# Altium project Multi_EMRT_MC.PrjPCB
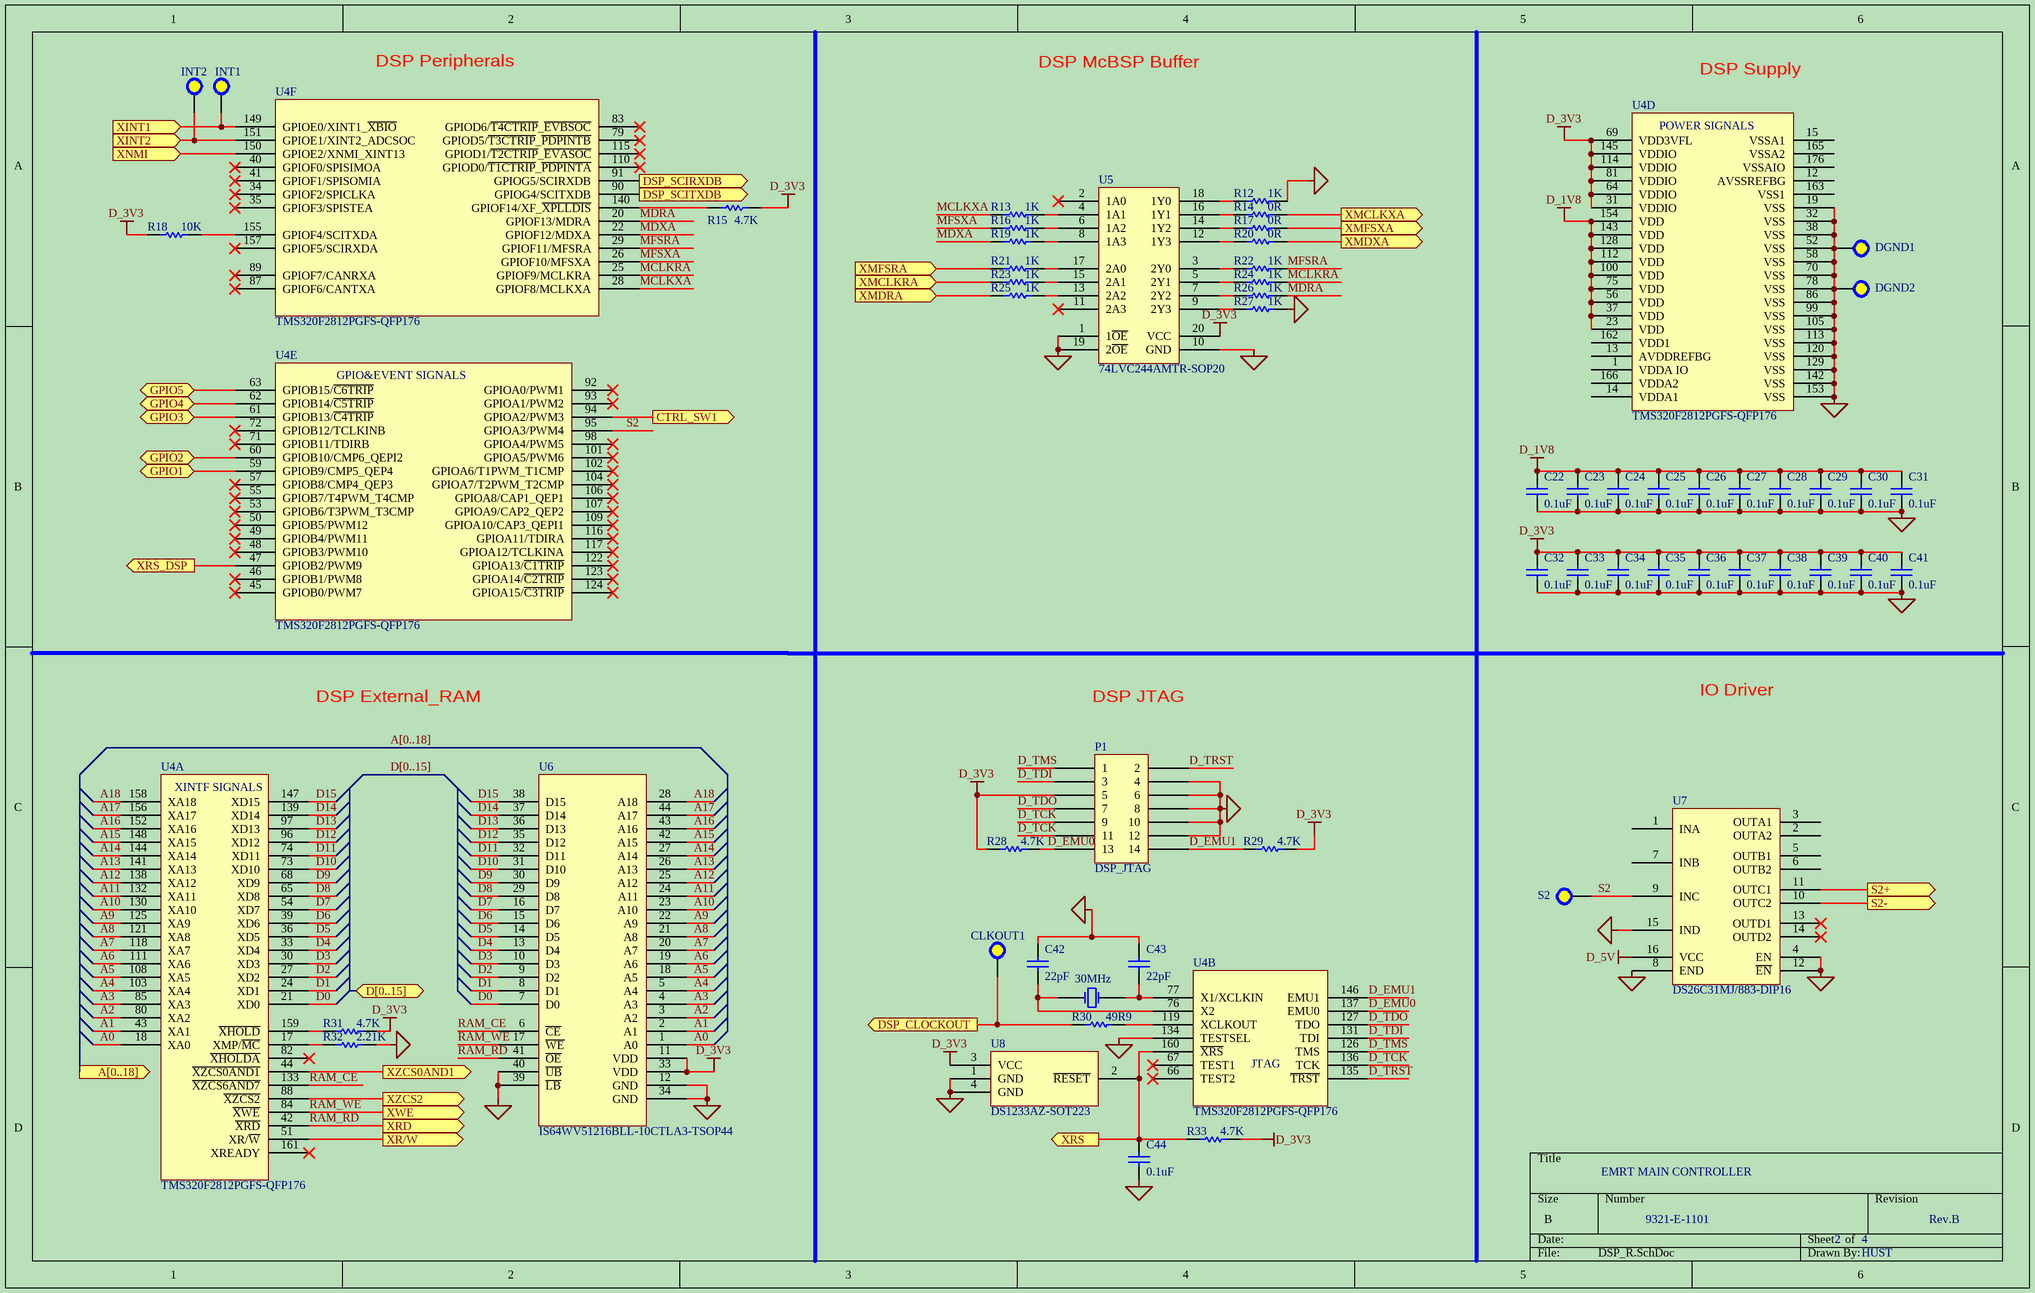
[diagram p0: DSP_R.SchDoc]
3 sheets, 148 parts. Net scope: flat (ports and power ports of the same name join across sheets).
Board file: Multi_EMRT_MC.PcbDoc
Sheets:
  DSP_R.SchDoc
  Assistant_Parameters.SchDoc
  ADC.SchDoc

## Sheet DSP_R.SchDoc: EMRT MAIN CONTROLLER
size B; DrawnBy: HUST; DocumentNumber: 9321-E-1101; Revision: Rev.B; SheetNumber: 2; SheetTotal: 4; PageSetup: Record=PageOptions|CenterHorizontal=True|CenterVertical=True|PrintScale=0.96|XCorrection=1.00|YCorrection=1.00|PrintKind=1|BorderSize=5000000|LeftOffset=0|BottomOffset=0|Orientation=2|PaperLength=1000|PaperWidth=1000|Scale=100|PaperSource=7|PrintQuality=1200|MediaType=0|DitherType=0|PaperKind=A4|PrintScaleMode=1

### Parts
C22  value 0.1uF  [CAPS0805_57]  (hidden comment: Cap)
C23  value 0.1uF  [CAPS0805_57]  (hidden comment: Cap)
C24  value 0.1uF  [CAPS0805_57]  (hidden comment: Cap)
C25  value 0.1uF  [CAPS0805_57]  (hidden comment: Cap)
C26  value 0.1uF  [CAPS0805_57]  (hidden comment: Cap)
C27  value 0.1uF  [CAPS0805_57]  (hidden comment: Cap)
C28  value 0.1uF  [CAPS0805_57]  (hidden comment: Cap)
C29  value 0.1uF  [CAPS0805_57]  (hidden comment: Cap)
C30  value 0.1uF  [CAPS0805_57]  (hidden comment: Cap)
C31  value 0.1uF  [CAPS0805_57]  (hidden comment: Cap)
C32  value 0.1uF  [CAPS0805_57]  (hidden comment: Cap)
C33  value 0.1uF  [CAPS0805_57]  (hidden comment: Cap)
C34  value 0.1uF  [CAPS0805_57]  (hidden comment: Cap)
C35  value 0.1uF  [CAPS0805_57]  (hidden comment: Cap)
C36  value 0.1uF  [CAPS0805_57]  (hidden comment: Cap)
C37  value 0.1uF  [CAPS0805_57]  (hidden comment: Cap)
C38  value 0.1uF  [CAPS0805_57]  (hidden comment: Cap)
C39  value 0.1uF  [CAPS0805_57]  (hidden comment: Cap)
C40  value 0.1uF  [CAPS0805_57]  (hidden comment: Cap)
C41  value 0.1uF  [CAPS0805_57]  (hidden comment: Cap)
C42  value 22pF  [CAPS0805_57]  (hidden comment: Cap)
C43  value 22pF  [CAPS0805_57]  (hidden comment: Cap)
C44  value 0.1uF  [CAPS0805_57]  (hidden comment: Cap)
CLKOUT1  TEST_SMALL  [test_small]  (value not drawn)
DGND1  TST_LARGE  [test_large]  (value not drawn)
DGND2  TST_LARGE  [test_large]  (value not drawn)
INT1  TEST_SMALL  [test_small]  (value not drawn)
INT2  TEST_SMALL  [test_small]  (value not drawn)
P1  DSP_JTAG  [HDR2X7]
R12  value 1K  [RESS0805]  (hidden comment: Res)
R13  value 1K  [RESS0805]  (hidden comment: Res)
R14  value 0R  [RESS0805]  (hidden comment: Res)
R15  value 4.7K  [RESS0805]  (hidden comment: Res)
R16  value 1K  [RESS0805]  (hidden comment: Res)
R17  value 0R  [RESS0805]  (hidden comment: Res)
R18  value 10K  [RESS0805]  (hidden comment: Res)
R19  value 1K  [RESS0805]  (hidden comment: Res)
R20  value 0R  [RESS0805]  (hidden comment: Res)
R21  value 1K  [RESS0805]  (hidden comment: Res)
R22  value 1K  [RESS0805]  (hidden comment: Res)
R23  value 1K  [RESS0805]  (hidden comment: Res)
R24  value 1K  [RESS0805]  (hidden comment: Res)
R25  value 1K  [RESS0805]  (hidden comment: Res)
R26  value 1K  [RESS0805]  (hidden comment: Res)
R27  value 1K  [RESS0805]  (hidden comment: Res)
R28  value 4.7K  [RESS0805]  (hidden comment: Res)
R29  value 4.7K  [RESS0805]  (hidden comment: Res)
R30  value 49R9  [RESS0805]  (hidden comment: Res)
R31  value 4.7K  [RESS0805]  (hidden comment: Res)
R32  value 2.21K  [RESS0805]  (hidden comment: Res)
R33  value 4.7K  [RESS0805]  (hidden comment: Res)
S2  TST_LARGE  [test_large]  (value not drawn)
U4  TMS320F2812PGFS-QFP176  [QFP176]  (parts A,B,D,E,F of 6)
U5  74LVC244AMTR-SOP20  [B-PDSO_20q1280×1030×265_p127]
U6  IS64WV51216BLL-10CTLA3-TSOP44  [TSOP44]
U7  DS26C31MJ/883-DIP16  [CDIP_16q785×305×200_d18_p100_i300]
U8  DS1233AZ-SOT223  [PDSO_3q700×650×180_p230]
Y1  XTAL  [XTALBCY_2q311×126×236_d13_p150]  (value not drawn)

### Ports
A[0..18] (out), CTRL_SW1 (out), D[0..15] (bidir), DSP_CLOCKOUT (out), DSP_SCIRXDB (in), DSP_SCITXDB (out), GPIO1 (bidir), GPIO2 (bidir), GPIO3 (bidir), GPIO4 (bidir), GPIO5 (bidir), S2+ (out), S2- (out), XINT1 (in), XINT2 (in), XMCLKRA (in), XMCLKXA (out), XMDRA (in), XMDXA (out), XMFSRA (in), XMFSXA (out), XNMI (in), XR/W (out), XRD (out), XRS (out), XRS_DSP (out), XWE (out), XZCS0AND1 (out), XZCS2 (out)

### Nets
D_1V8: C22.2 C23.2 C24.2 C25.2 C26.2 C27.2 C28.2 C29.2 C30.2 C31.2 U4.23(VDD) U4.37(VDD) U4.56(VDD) U4.75(VDD) U4.100(VDD) U4.112(VDD) U4.128(VDD) U4.143(VDD) U4.154(VDD)
D_3V3: C32.2 C33.2 C34.2 C35.2 C36.2 C37.2 C38.2 C39.2 C40.2 C41.2 P1.5 R15.1 R18.2 R28.2 R29.1 R31.1 R33.1 U4.31(VDDIO) U4.64(VDDIO) U4.69(VDD3VFL) U4.81(VDDIO) U4.114(VDDIO) U4.145(VDDIO) U5.20(VCC) U6.11(VDD) U6.33(VDD) U8.3(VCC)
D_5V: U7.16(VCC)
DGND: C22.1 C23.1 C24.1 C25.1 C26.1 C27.1 C28.1 C29.1 C30.1 C31.1 C32.1 C33.1 C34.1 C35.1 C36.1 C37.1 C38.1 C39.1 C40.1 C41.1 C42.2 C43.2 C44.1 DGND1.1 DGND2.1 P1.4 P1.6 P1.8 P1.10 P1.12 R12.1 R27.1 R32.1 U4.19(VSS) U4.32(VSS) U4.38(VSS) U4.52(VSS) U4.58(VSS) U4.70(VSS) U4.78(VSS) U4.86(VSS) U4.99(VSS) U4.105(VSS) U4.113(VSS) U4.120(VSS) U4.129(VSS) U4.134(TESTSEL) U4.142(VSS) U4.153(VSS) U5.1(1~{OE}) U5.10(GND) U5.19(2~{OE}) U6.12(GND) U6.34(GND) U6.39(~{LB}) U6.40(~{UB}) U7.4(EN) U7.8(END) U7.12(~{EN}) U7.15(IND) U8.1(GND) U8.4(GND)
A0: U4.18(XA0) U6.1(A0)
A1: U4.43(XA1) U6.2(A1)
A2: U4.80(XA2) U6.3(A2)
A3: U4.85(XA3) U6.4(A3)
A4: U4.103(XA4) U6.5(A4)
A5: U4.108(XA5) U6.18(A5)
A6: U4.111(XA6) U6.19(A6)
A7: U4.118(XA7) U6.20(A7)
A8: U4.121(XA8) U6.21(A8)
A9: U4.125(XA9) U6.22(A9)
A10: U4.130(XA10) U6.23(A10)
A11: U4.132(XA11) U6.24(A11)
A12: U4.138(XA12) U6.25(A12)
A13: U4.141(XA13) U6.26(A13)
A14: U4.144(XA14) U6.27(A14)
A15: U4.148(XA15) U6.42(A15)
A16: U4.152(XA16) U6.43(A16)
A17: U4.156(XA17) U6.44(A17)
A18: U4.158(XA18) U6.28(A18)
D0: U4.21(XD0) U6.7(D0)
D1: U4.24(XD1) U6.8(D1)
D2: U4.27(XD2) U6.9(D2)
D3: U4.30(XD3) U6.10(D3)
D4: U4.33(XD4) U6.13(D4)
D5: U4.36(XD5) U6.14(D5)
D6: U4.39(XD6) U6.15(D6)
D7: U4.54(XD7) U6.16(D7)
D8: U4.65(XD8) U6.29(D8)
D9: U4.68(XD9) U6.30(D9)
D10: U4.73(XD10) U6.31(D10)
D11: U4.74(XD11) U6.32(D11)
D12: U4.96(XD12) U6.35(D12)
D13: U4.97(XD13) U6.36(D13)
D14: U4.139(XD14) U6.37(D14)
D15: U4.147(XD15) U6.38(D15)
D_EMU0: P1.13 R28.1 U4.137(EMU0)
D_EMU1: P1.14 R29.2 U4.146(EMU1)
D_TCK: P1.9 P1.11 U4.136(TCK)
D_TDI: P1.3 U4.131(TDI)
D_TDO: P1.7 U4.127(TDO)
D_TMS: P1.1 U4.126(TMS)
D_TRST: P1.2 U4.135(~{TRST})
MCLKRA: R24.1 U4.25(GPIOF9/MCLKRA)
MCLKXA: R13.2 U4.28(GPIOF8/MCLKXA)
MDRA: R26.1 U4.20(GPIOF13/MDRA)
MDXA: R19.2 U4.22(GPIOF12/MDXA)
MFSRA: R22.1 U4.29(GPIOF11/MFSRA)
MFSXA: R16.2 U4.26(GPIOF10/MFSXA)
RAM_CE: U4.133(~{XZCS6AND7}) U6.6(~{CE})
RAM_RD: U4.42(~{XRD}) U6.41(~{OE}) ; port XRD
RAM_WE: U4.84(~{XWE}) U6.17(~{WE}) ; port XWE
S2: S2.1 U4.95(GPIOA3/PWM4) U7.9(INC)
NetC42_1: C42.1 U4.76(X2) Y1.2(OSC2)
NetC43_1: C43.1 U4.77(X1/XCLKIN) Y1.1(OSC1)
NetC44_2: C44.2 R33.2 U4.160(~{XRS}) U8.2(~{RESET}) ; port XRS
NetCLKOUT1_1: CLKOUT1.1 R30.2 ; port DSP_CLOCKOUT
NetCTRL_SW1_1: U4.94(GPIOA2/PWM3) ; port CTRL_SW1
NetINT1_1: INT1.1 U4.149(GPIOE0/XINT1_~{XBIO}) ; port XINT1
NetINT2_1: INT2.1 U4.151(GPIOE1/XINT2_ADCSOC) ; port XINT2
NetR12_2: R12.2 U5.18(1Y0)
NetR13_1: R13.1 U5.4(1A1)
NetR14_1: R14.1 ; port XMCLKXA
NetR14_2: R14.2 U5.16(1Y1)
NetR15_2: R15.2 U4.140(GPIOF14/XF_~{XPLLDIS})
NetR16_1: R16.1 U5.6(1A2)
NetR17_1: R17.1 ; port XMFSXA
NetR17_2: R17.2 U5.14(1Y2)
NetR18_1: R18.1 U4.155(GPIOF4/SCITXDA)
NetR19_1: R19.1 U5.8(1A3)
NetR20_1: R20.1 ; port XMDXA
NetR20_2: R20.2 U5.12(1Y3)
NetR21_1: R21.1 U5.17(2A0)
NetR21_2: R21.2 ; port XMFSRA
NetR22_2: R22.2 U5.3(2Y0)
NetR23_1: R23.1 U5.15(2A1)
NetR23_2: R23.2 ; port XMCLKRA
NetR24_2: R24.2 U5.5(2Y1)
NetR25_1: R25.1 U5.13(2A2)
NetR25_2: R25.2 ; port XMDRA
NetR26_2: R26.2 U5.7(2Y2)
NetR27_2: R27.2 U5.9(2Y3)
NetR30_1: R30.1 U4.119(XCLKOUT)
NetR31_2: R31.2 U4.159(~{XHOLD})
NetR32_2: R32.2 U4.17(XMP/~{MC})
NetU4_44: U4.44(~{XZCS0AND1}) ; port XZCS0AND1
NetU4_47: U4.47(GPIOB2/PWM9) ; port XRS_DSP
NetU4_51: U4.51(XR/~{W}) ; port XR/W
NetU4_59: U4.59(GPIOB9/CMP5_QEP4) ; port GPIO1
NetU4_60: U4.60(GPIOB10/CMP6_QEPI2) ; port GPIO2
NetU4_61: U4.61(GPIOB13/~{C4TRIP}) ; port GPIO3
NetU4_62: U4.62(GPIOB14/~{C5TRIP}) ; port GPIO4
NetU4_63: U4.63(GPIOB15/~{C6TRIP}) ; port GPIO5
NetU4_88: U4.88(~{XZCS2}) ; port XZCS2
NetU4_90: U4.90(GPIOG4/SCITXDB) ; port DSP_SCITXDB
NetU4_91: U4.91(GPIOG5/SCIRXDB) ; port DSP_SCIRXDB
NetU4_150: U4.150(GPIOE2/XNMI_XINT13) ; port XNMI
NetU7_10: U7.10(OUTC2) ; port S2-
NetU7_11: U7.11(OUTC1) ; port S2+

Not connected (* = marked no-connect by the designer): U4 1(VDDA_IO) 12(AVSSREFBG) 13(AVDDREFBG) 14(VDDA1) 15(VSSA1) 34(GPIOF2/SPICLKA)* 35(GPIOF3/SPISTEA)* 40(GPIOF0/SPISIMOA)* 41(GPIOF1/SPISOMIA)* 45(GPIOB0/PWM7)* 46(GPIOB1/PWM8)* 48(GPIOB3/PWM10)* 49(GPIOB4/PWM11)* 50(GPIOB5/PWM12)* 53(GPIOB6/T3PWM_T3CMP)* 55(GPIOB7/T4PWM_T4CMP)* 57(GPIOB8/CMP4_QEP3)* 66(TEST2)* 67(TEST1)* 71(GPIOB11/TDIRB)* 72(GPIOB12/TCLKINB)* 79(GPIOD5/~{T3CTRIP}_~{PDPINTB})* 82(~{XHOLDA})* 83(GPIOD6/~{T4CTRIP}_~{EVBSOC})* 87(GPIOF6/CANTXA)* 89(GPIOF7/CANRXA)* 92(GPIOA0/PWM1)* 93(GPIOA1/PWM2)* 98(GPIOA4/PWM5)* 101(GPIOA5/PWM6)* 102(GPIOA6/T1PWM_T1CMP)* 104(GPIOA7/T2PWM_T2CMP)* 106(GPIOA8/CAP1_QEP1)* 107(GPIOA9/CAP2_QEP2)* 109(GPIOA10/CAP3_QEPI1)* 110(GPIOD0/~{T1CTRIP}_~{PDPINTA})* 115(GPIOD1/~{T2CTRIP}_~{EVASOC})* 116(GPIOA11/TDIRA)* 117(GPIOA12/TCLKINA)* 122(GPIOA13/~{C1TRIP})* 123(GPIOA14/~{C2TRIP})* 124(GPIOA15/~{C3TRIP})* 157(GPIOF5/SCIRXDA)* 161(XREADY)* 162(VDD1) 163(VSS1) 165(VSSA2) 166(VDDA2) 176(VSSAIO); U5 2(1A0)* 11(2A3)*; U7 1(INA) 2(OUTA2) 3(OUTA1) 5(OUTB1) 6(OUTB2) 7(INB) 13(OUTD1)* 14(OUTD2)*

### Buses and harness runs
bus A[0..18] = port A[0..18]
bus D[0..15] = port D[0..15]

### Notes on the sheet
- DSP Peripherals
- DSP McBSP Buffer
- DSP Supply
- DSP External_RAM
- DSP JTAG
- IO Driver
- (in symbol TMS320F2812(176PIN), part A) XINTF SIGNALS
- (in symbol TMS320F2812(176PIN), part B) JTAG
- (in symbol TMS320F2812(176PIN), part D) POWER SIGNALS
- (in symbol TMS320F2812(176PIN), part E) GPIO&EVENT SIGNALS
- (in symbol XTAL) 30MHz

### Library data of the parts
C22-C44 = Y20025084: Capacitor; 制造商型号: VJ0805H104KXA; parent: 01; 精度: ±10%; 描述: VISHAY;VJ0805H104KXA;0.1uF;±10%;50V;X8R;150℃;CAP0805; 安装形式: SMT; 湿敏等级（回流焊峰值）: 0; 产品外形尺寸<长>: 0.079±0.008 in; 产品外形尺寸<宽>: 0.049±0.008 in; 产品外形尺寸<高>: 0.057 in; id: wt.part.WTPartMaster:1053152; state: APPROVED; folder: /Default/电容/VJ0805H104KXA; Part Number: Y20025084; HelpURL: \\10.185.226.160\altium_center_db\DATASHEET\VISHAY VJ X8R.pdf; Library Path: Cap.SchLib; Library Ref: Cap; Footprint Path: VISHAY VJ0805_57.PcbLib; Footprint Ref: CAPS0805_57; pname: VJ0805H104KXA; Library Path 2: 0; Library Ref 2: 0; Footprint Path 2: 0; Footprint Ref 2: 0; Footprint Path 3: 0; Footprint Ref 3: 0
DGND1 DGND2 S2 = TEST_LARGE
R12-R33 = Res: Semiconductor Resistor; Manufacturer: Generic Components; Class: Passive; Published: 08/06/2000; Publisher: Altium Hobart Technology Centre; SubClass: Resistor
U4 = TMS320F2812(176PIN)
U5 = 74LVC244AMTR
U6 = IS61LV51216
U7 = DS26LVC31
U8 = DS1233AZ-15
Y1 = XTAL: Crystal Oscillator; Published: 8-Jun-2000; LatestRevisionDate: 17-Jul-2002; LatestRevisionNote: Re-released for DXP Platform.; Publisher: Altium Limited

## Sheet Assistant_Parameters.SchDoc: EMRT MAIN CONTROLLER
size A4; DrawnBy: HUST; DocumentNumber: 9321-E-1101; Revision: REV.B; SheetNumber: 4; SheetTotal: 4
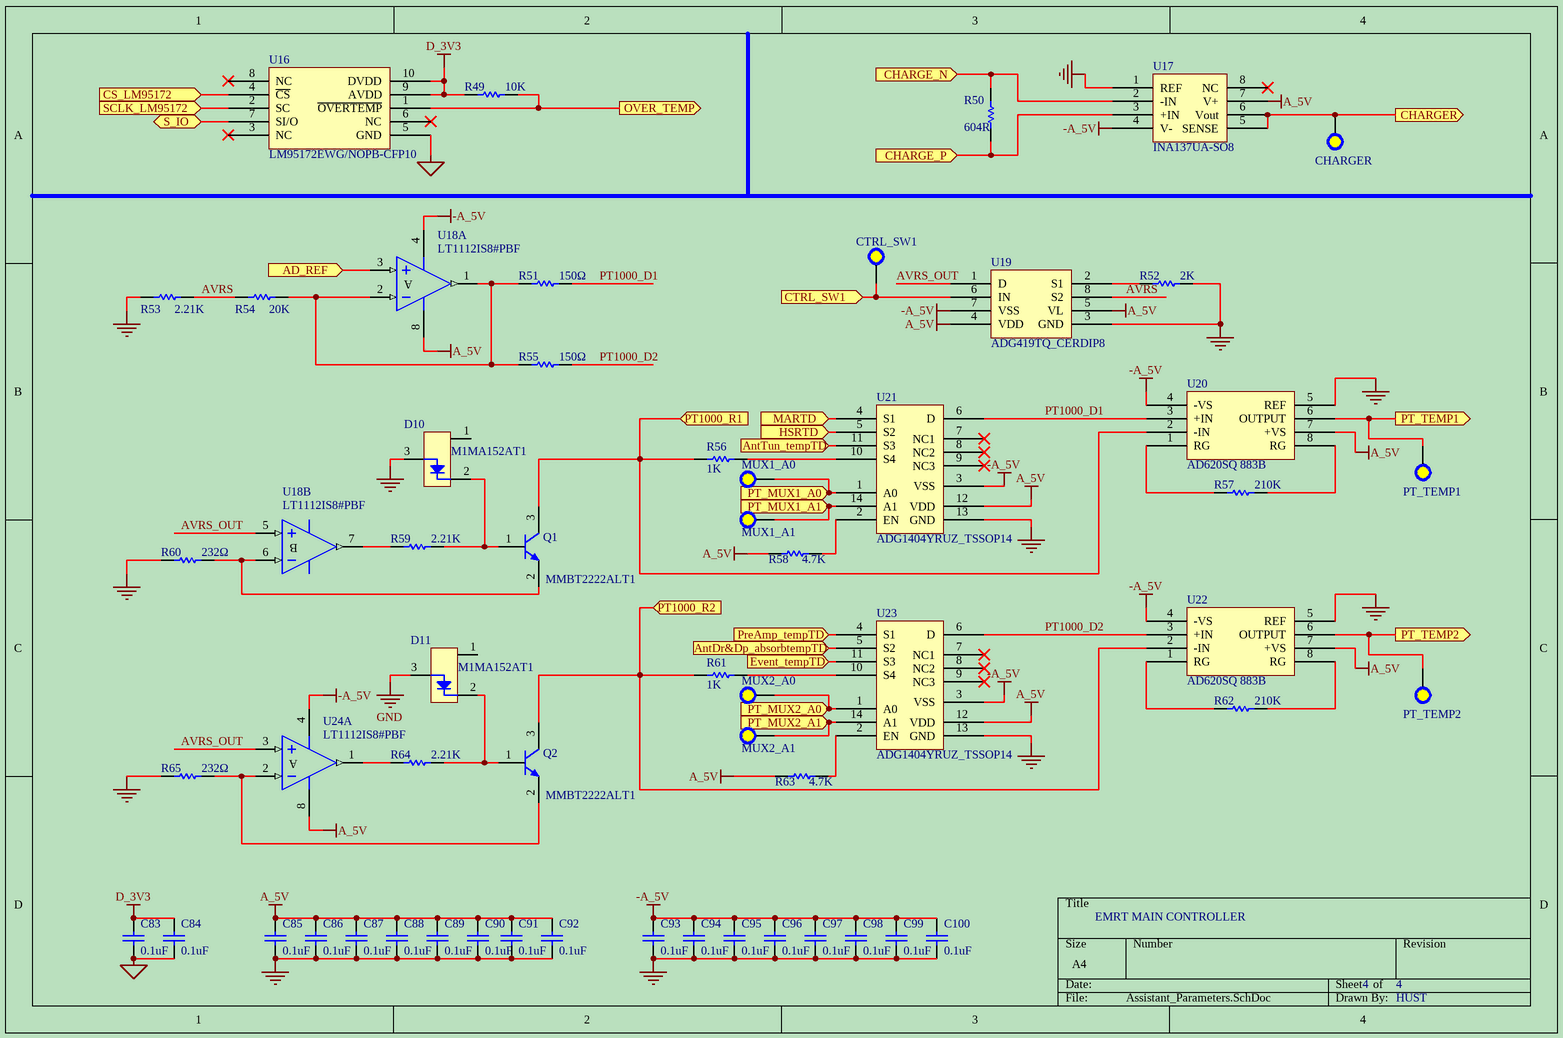
[diagram p1: Assistant_Parameters.SchDoc]

### Parts
C83  value 0.1uF  [CAPS0805_57]  (hidden comment: Cap)
C84  value 0.1uF  [CAPS0805_57]  (hidden comment: Cap)
C85  value 0.1uF  [CAPS0805_57]  (hidden comment: Cap)
C86  Cap  [CAPS0805_57]  (value not drawn)
C87  value 0.1uF  [CAPS0805_57]  (hidden comment: Cap)
C88  value 0.1uF  [CAPS0805_57]  (hidden comment: Cap)
C89  value 0.1uF  [CAPS0805_57]  (hidden comment: Cap)
C90  value 0.1uF  [CAPS0805_57]  (hidden comment: Cap)
C91  value 0.1uF  [CAPS0805_57]  (hidden comment: Cap)
C92  value 0.1uF  [CAPS0805_57]  (hidden comment: Cap)
C93  value 0.1uF  [CAPS0805_57]  (hidden comment: Cap)
C94  Cap  [CAPS0805_57]  (value not drawn)
C95  value 0.1uF  [CAPS0805_57]  (hidden comment: Cap)
C96  value 0.1uF  [CAPS0805_57]  (hidden comment: Cap)
C97  value 0.1uF  [CAPS0805_57]  (hidden comment: Cap)
C98  value 0.1uF  [CAPS0805_57]  (hidden comment: Cap)
C99  value 0.1uF  [CAPS0805_57]  (hidden comment: Cap)
C100  value 0.1uF  [CAPS0805_57]  (hidden comment: Cap)
CHARGER  TEST_SMALL  [test_small]  (value not drawn)
CTRL_SW1  TEST_SMALL  [test_small]  (value not drawn)
D10  M1MA152AT1  [SC-59]
D11  M1MA152AT1  [SC-59]
MUX1_A0  TEST_SMALL  [test_small]  (value not drawn)
MUX1_A1  TEST_SMALL  [test_small]  (value not drawn)
MUX2_A0  TEST_SMALL  [test_small]  (value not drawn)
MUX2_A1  TEST_SMALL  [test_small]  (value not drawn)
PT_TEMP1  TEST_SMALL  [test_small]  (value not drawn)
PT_TEMP2  TEST_SMALL  [test_small]  (value not drawn)
Q1  MMBT2222ALT1  [V-PDSO_3q290×240×100_p190]
Q2  MMBT2222ALT1  [V-PDSO_3q290×240×100_p190]
R49  value 10K  [RESS0805]  (hidden comment: Res)
R50  value 604R  [RESS0805]  (hidden comment: Res)
R51  value 150Ω  [RESS0805]  (hidden comment: Res)
R52  value 2K  [RESS0805]  (hidden comment: Res)
R53  value 2.21K  [RESS0805]  (hidden comment: Res)
R54  value 20K  [RESS0805]  (hidden comment: Res)
R55  value 150Ω  [RESS0805]  (hidden comment: Res)
R56  value 1K  [RESS0805]  (hidden comment: Res)
R57  value 210K  [RESS0805]  (hidden comment: Res)
R58  value 4.7K  [RESS0805]  (hidden comment: Res)
R59  value 2.21K  [RESS0805]  (hidden comment: Res)
R60  value 232Ω  [RESS0805]  (hidden comment: Res)
R61  value 1K  [RESS0805]  (hidden comment: Res)
R62  value 210K  [RESS0805]  (hidden comment: Res)
R63  value 4.7K  [RESS0805]  (hidden comment: Res)
R64  value 2.21K  [RESS0805]  (hidden comment: Res)
R65  value 232Ω  [RESS0805]  (hidden comment: Res)
U16  LM95172EWG/NOPB-CFP10  [SOP10]
U17  INA137UA-SO8  [PDSO_8q600×490×175_p127]
U18  LT1112IS8#PBF  [PDSO_8q600×490×175_p127]  (parts A,B of 2)
U19  ADG419TQ_CERDIP8  [CDIP_8q405×305×200_d19_p100_i300]
U20  AD620SQ 883B  [CDIP_8q405×305×200_d19_p100_i300]
U21  ADG1404YRUZ_TSSOP14  [TSSOP14]
U22  AD620SQ 883B  [CDIP_8q405×305×200_d19_p100_i300]
U23  ADG1404YRUZ_TSSOP14  [TSSOP14]
U24  LT1112IS8#PBF  [PDSO_8q600×490×175_p127]  (part A of 2)

### Ports
AD_REF (in), AntDr&Dp_absorbtempTD (in), AntTun_tempTD (in), CHARGE_N (in), CHARGE_P (in), CHARGER (out), CS_LM95172 (in), CTRL_SW1 (in), Event_tempTD (in), HSRTD (in), MARTD (in), OVER_TEMP (out), PreAmp_tempTD (in), PT1000_R1 (in), PT1000_R2 (in), PT_MUX1_A0 (in), PT_MUX1_A1 (in), PT_MUX2_A0 (in), PT_MUX2_A1 (in), PT_TEMP1 (out), PT_TEMP2 (out), S_IO (bidir), SCLK_LM95172 (in)

### Nets
-A_5V: C93.2 C94.1 C95.2 C96.2 C97.2 C98.2 C99.2 C100.2 U17.4(V-) U18.4(V-) U19.7(VSS) U20.4(-VS) U21.3(VSS) U22.4(-VS) U23.3(VSS) U24.4(V-)
A_5V: C85.2 C86.1 C87.2 C88.1 C89.2 C90.2 C91.2 C92.2 R58.1 R63.1 U17.7(V+) U18.8(V+) U19.4(VDD) U19.5(VL) U20.7(+VS) U21.12(VDD) U22.7(+VS) U23.12(VDD) U24.8(V+)
D_3V3: C83.2 C84.2 R49.2 U16.9(AVDD) U16.10(DVDD)
DGND: C83.1 C84.1 U16.5(GND)
GND: C85.1 C86.2 C87.1 C88.2 C89.1 C90.1 C91.1 C92.1 C93.1 C94.2 C95.1 C96.1 C97.1 C98.1 C99.1 C100.1 D10.3 D11.3 R52.1 R53.2 R60.2 R65.2 U17.1(REF) U19.3(GND) U20.5(REF) U21.13(GND) U22.5(REF) U23.13(GND)
AD_REF: U18.3(IN+) ; port AD_REF
AVRS: R53.1 R54.2 U19.8(S2)
AVRS_OUT: U18.5(IN+) U19.1(D) U24.3(IN+)
PT1000_D1: R51.1 U20.3(+IN) U21.6(D)
PT1000_D2: R55.1 U22.3(+IN) U23.6(D)
NetCHARGER_1: CHARGER.1 U17.5(SENSE) U17.6(Vout) ; port CHARGER
NetCTRL_SW1_1: CTRL_SW1.1 U19.6(IN) ; port CTRL_SW1
NetD10_2: D10.2 Q1.1(B) R59.1
NetD11_2: D11.2 Q2.1(B) R64.1
NetMUX1_A0_1: MUX1_A0.1 U21.1(A0) ; port PT_MUX1_A0
NetMUX1_A1_1: MUX1_A1.1 U21.14(A1) ; port PT_MUX1_A1
NetMUX2_A0_1: MUX2_A0.1 U23.1(A0) ; port PT_MUX2_A0
NetMUX2_A1_1: MUX2_A1.1 U23.14(A1) ; port PT_MUX2_A1
NetPT_TEMP1_1: PT_TEMP1.1 U20.6(OUTPUT) ; port PT_TEMP1
NetPT_TEMP2_1: PT_TEMP2.1 U22.6(OUTPUT) ; port PT_TEMP2
NetQ1_2: Q1.2(E) R60.1 U18.6(IN-)
NetQ1_3: Q1.3(C) R56.1 U20.2(-IN) ; port PT1000_R1
NetQ2_2: Q2.2(E) R65.1 U24.2(IN-)
NetQ2_3: Q2.3(C) R61.1 U22.2(-IN) ; port PT1000_R2
NetR49_1: R49.1 U16.1(~{OVERTEMP}) ; port OVER_TEMP
NetR50_1: R50.1 U17.2(-IN) ; port CHARGE_N
NetR50_2: R50.2 U17.3(+IN) ; port CHARGE_P
NetR51_2: R51.2 R54.1 R55.2 U18.1(OUT) U18.2(IN-)
NetR52_2: R52.2 U19.2(S1)
NetR56_2: R56.2 U21.10(S4)
NetR57_1: R57.1 U20.8(RG)
NetR57_2: R57.2 U20.1(RG)
NetR58_2: R58.2 U21.2(EN)
NetR59_2: R59.2 U18.7(OUT)
NetR61_2: R61.2 U23.10(S4)
NetR62_1: R62.1 U22.8(RG)
NetR62_2: R62.2 U22.1(RG)
NetR63_2: R63.2 U23.2(EN)
NetR64_2: R64.2 U24.1(OUT)
NetU16_2: U16.2(SC) ; port SCLK_LM95172
NetU16_4: U16.4(~{CS}) ; port CS_LM95172
NetU16_7: U16.7(SI/O) ; port S_IO
NetU21_4: U21.4(S1) ; port MARTD
NetU21_5: U21.5(S2) ; port HSRTD
NetU21_11: U21.11(S3) ; port AntTun_tempTD
NetU23_4: U23.4(S1) ; port PreAmp_tempTD
NetU23_5: U23.5(S2) ; port AntDr&Dp_absorbtempTD
NetU23_11: U23.11(S3) ; port Event_tempTD

Not connected (* = marked no-connect by the designer): D10 1; D11 1; U16 3(NC)* 6(NC)* 8(NC)*; U17 8(NC)*; U21 7(NC1)* 8(NC2)* 9(NC3)*; U23 7(NC1)* 8(NC2)* 9(NC3)*

### Notes on the sheet
- (in symbol LT1112IS8#PBF, part A) A
- (in symbol LT1112IS8#PBF, part B) B
- (in symbol Y20002409) 0.1uF

### Library data of the parts
C83 C84 C87 C93 = Y20025084: as C22 on sheet DSP_R; Part Number: Y20025084; HelpURL: \\10.185.226.160\altium_center_db\DATASHEET\VISHAY VJ X8R.pdf; Library Path: Cap.SchLib; Library Ref: Cap; Footprint Path: VISHAY VJ0805_57.PcbLib; Footprint Ref: CAPS0805_57; pname: VJ0805H104KXA; Library Path 2: 0; Library Ref 2: 0; Footprint Path 2: 0; Footprint Ref 2: 0; Footprint Path 3: 0; Footprint Ref 3: 0
C85 C88-C92 C95-C100 = Y20024100: Capacitor; 制造商型号: C0805C104J5RAC; 精度: ±5%; 描述: KEMET;C0805C104J5RAC;0.1uF;±5%;50V;X7R;125℃;CAP0805 MSL1; 安装形式: SMT; 湿敏等级（回流焊峰值）: MSL1; 产品外形尺寸<长>: 2.0±0.2mm; 产品外形尺寸<宽>: 1.25±0.2mm; 产品外形尺寸<高>: 0.78±0.1mm; id: wt.part.WTPartMaster:1054484; state: APPROVED; folder: /Default/电容/C0805C104J5RAC; Part Number: Y20024100; HelpURL: \\10.185.226.160\altium_center_db\DATASHEET\KEMET X7R Dielectric(Commercial Grade).pdf; pname: C0805C104J5RAC
C86 C94 = Y20002409: Capacitor; 精度: ±5%; 描述: AVX;CCR05CG200JP;20pF;30±ppm/℃;±5%;200V;125℃;CAP RADIAL; 安装形式: THT; 产品外形尺寸<长>: 4.83±0.25mm; 产品外形尺寸<宽>: 2.29±0.25mm; pname: CCR05CG200JP; id: wt.part.WTPartMaster:1052659; state: APPROVED; folder: /Default/电容/CCR05CG200JP; Part Number: Y20002409; 产品外形尺寸<高>: 4.83±0.25mm; HelpURL: \\10.185.226.160\altium_center_db\DATASHEET\AVX MIL-PRF-20RADIAL&AXIAL.pdf; 制造商型号: CCR05CG200JP
D10 D11 = M1MA152AT1: Part Number: Y20032999
Q1 Q2 = MMBT2222ALT1: General Purpose Transistor NPN Silicon
R49-R65 = Res: as R12 on sheet DSP_R; Published: 08/06/2000; Publisher: Altium Hobart Technology Centre; SubClass: Resistor
U16 = LM95172EWG/NOPB
U17 = INA137
U18 U24 = LT1112IS8#PBF: Precision, Single-Supply Dual Operational Amplifier
U19 = ADG419TQ/883
U20 U22 = AD620
U21 U23 = ADG1404

## Sheet ADC.SchDoc
size A4
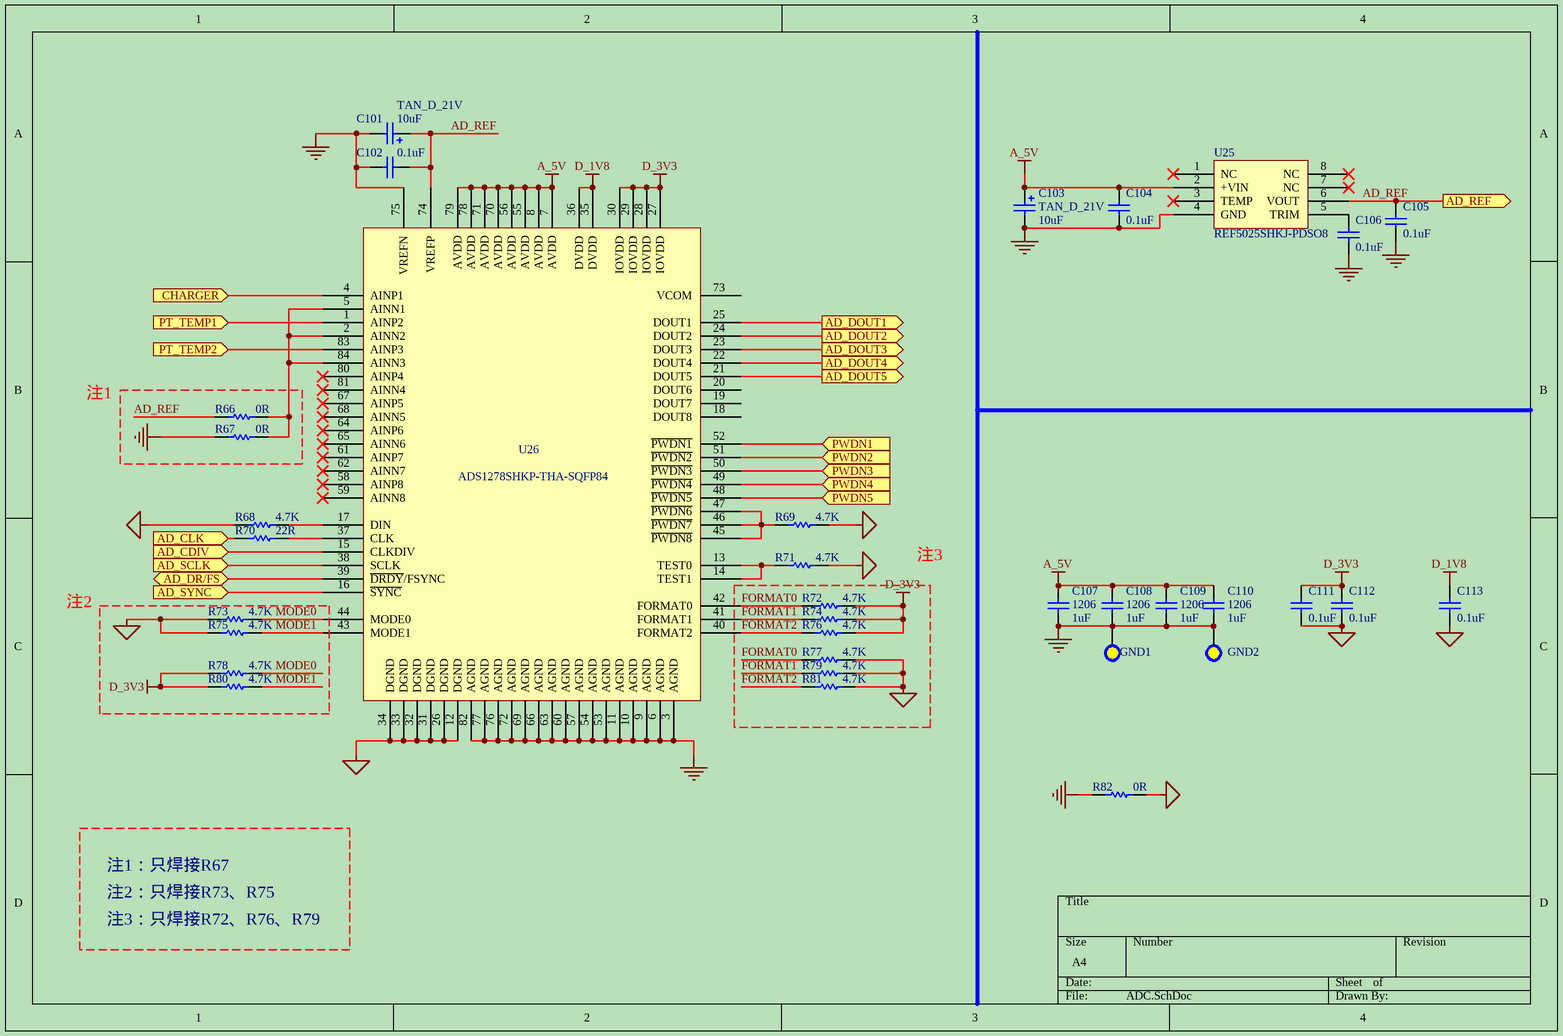
[diagram p2: ADC.SchDoc]

### Parts
C101  TAN_D_21V  value 10uF  [CAPSP_2q2917]
C102  value 0.1uF  [CAPS0805_57]  (hidden comment: Cap)
C103  TAN_D_21V  value 10uF  [CAPSP_2q2917]
C104  value 0.1uF  [CAPS0805_57]  (hidden comment: Cap)
C105  value 0.1uF  [CAPS0805_57]  (hidden comment: Cap)
C106  value 0.1uF  [CAPS0805_57]  (hidden comment: Cap)
C107  1206  value 1uF  [CAPS1206_43]
C108  1206  value 1uF  [CAPS1206_43]
C109  1206  value 1uF  [CAPS1206_43]
C110  1206  value 1uF  [CAPS1206_43]
C111  value 0.1uF  [CAPS0805_57]  (hidden comment: Cap)
C112  value 0.1uF  [CAPS0805_57]  (hidden comment: Cap)
C113  value 0.1uF  [CAPS0805_57]  (hidden comment: Cap)
GND1  TST_LARGE  [test_large]  (value not drawn)
GND2  TST_LARGE  [test_large]  (value not drawn)
R66  value 0R  [RESS0805]  (hidden comment: Res)
R67  value 0R  [RESS0805]  (hidden comment: Res)
R68  value 4.7K  [RESS0805]  (hidden comment: Res)
R69  value 4.7K  [RESS0805]  (hidden comment: Res)
R70  value 22R  [RESS0805]  (hidden comment: Res)
R71  value 4.7K  [RESS0805]  (hidden comment: Res)
R72  value 4.7K  [RESS0805]  (hidden comment: Res)
R73  value 4.7K  [RESS0805]  (hidden comment: Res)
R74  value 4.7K  [RESS0805]  (hidden comment: Res)
R75  value 4.7K  [RESS0805]  (hidden comment: Res)
R76  value 4.7K  [RESS0805]  (hidden comment: Res)
R77  value 4.7K  [RESS0805]  (hidden comment: Res)
R78  value 4.7K  [RESS0805]  (hidden comment: Res)
R79  value 4.7K  [RESS0805]  (hidden comment: Res)
R80  value 4.7K  [RESS0805]  (hidden comment: Res)
R81  value 4.7K  [RESS0805]  (hidden comment: Res)
R82  value 0R  [RESS0805]  (hidden comment: Res)
U25  REF5025SHKJ-PDSO8  [PDSO8]
U26  ADS1278SHKP-THA-SQFP84  [HB-CQFP_84q1933×1933×280_p50 - duplicate]

### Ports
AD_CDIV (in), AD_CLK (in), AD_DOUT1 (out), AD_DOUT2 (out), AD_DOUT3 (out), AD_DOUT4 (out), AD_DOUT5 (out), AD_DR/FS (bidir), AD_REF (out), AD_SCLK (in), AD_SYNC (in), CHARGER (in), PT_TEMP1 (in), PT_TEMP2 (in), PWDN1 (in), PWDN2 (in), PWDN3 (in), PWDN4 (in), PWDN5 (in)

### Nets
A_5V: C103.1 C104.2 C107.2 C108.2 C109.2 C110.2 U25.2(+VIN) U26.7(AVDD) U26.8(AVDD) U26.55(AVDD) U26.56(AVDD) U26.70(AVDD) U26.71(AVDD) U26.78(AVDD) U26.79(AVDD)
D_1V8: C113.2 U26.35(DVDD) U26.36(DVDD)
D_3V3: C111.2 C112.2 R72.1 R74.1 R76.1 R78.2 R80.2 U26.27(IOVDD) U26.28(IOVDD) U26.29(IOVDD) U26.30(IOVDD)
DGND: C111.1 C112.1 C113.1 R68.2 R69.1 R71.1 R73.2 R75.2 R77.1 R79.1 R81.1 R82.1 U26.12(DGND) U26.26(DGND) U26.31(DGND) U26.32(DGND) U26.33(DGND) U26.34(DGND)
GND: C101.2 C102.2 C103.2 C104.1 C105.1 C106.1 C107.1 C108.1 C109.1 C110.1 GND1.1 GND2.1 R67.2 R82.2 U25.4(GND) U26.3(AGND) U26.6(AGND) U26.9(AGND) U26.10(AGND) U26.11(AGND) U26.53(AGND) U26.54(AGND) U26.57(AGND) U26.60(AGND) U26.63(AGND) U26.66(AGND) U26.69(AGND) U26.72(AGND) U26.75(VREFN) U26.76(AGND) U26.77(AGND) U26.82(AGND)
AD_REF: C101.1 C102.1 C105.2 R66.2 U25.6(VOUT) U26.74(VREFP) ; port AD_REF
FORMAT0: R72.2 R77.2 U26.42(FORMAT0)
FORMAT1: R74.2 R79.2 U26.41(FORMAT1)
FORMAT2: R76.2 R81.2 U26.40(FORMAT2)
MODE0: R73.1 R78.1 U26.44(MODE0)
MODE1: R75.1 R80.1 U26.43(MODE1)
NetC106_2: C106.2 U25.5(TRIM)
NetCHARGER_1: U26.4(AINP1) ; port CHARGER
NetPT_TEMP1_1: U26.1(AINP2) ; port PT_TEMP1
NetPT_TEMP2_1: U26.83(AINP3) ; port PT_TEMP2
NetR66_1: R66.1 R67.1 U26.2(AINN2) U26.5(AINN1) U26.84(AINN3)
NetR68_1: R68.1 U26.17(DIN)
NetR69_2: R69.2 U26.45(~{PWDN8}) U26.46(~{PWDN7}) U26.47(~{PWDN6})
NetR70_1: R70.1 U26.37(CLK)
NetR70_2: R70.2 ; port AD_CLK
NetR71_2: R71.2 U26.13(TEST0) U26.14(TEST1)
NetU26_15: U26.15(CLKDIV) ; port AD_CDIV
NetU26_16: U26.16(~{SYNC}) ; port AD_SYNC
NetU26_21: U26.21(DOUT5) ; port AD_DOUT5
NetU26_22: U26.22(DOUT4) ; port AD_DOUT4
NetU26_23: U26.23(DOUT3) ; port AD_DOUT3
NetU26_24: U26.24(DOUT2) ; port AD_DOUT2
NetU26_25: U26.25(DOUT1) ; port AD_DOUT1
NetU26_38: U26.38(SCLK) ; port AD_SCLK
NetU26_39: U26.39(~{DRDY}/FSYNC) ; port AD_DR/FS
NetU26_48: U26.48(~{PWDN5}) ; port PWDN5
NetU26_49: U26.49(~{PWDN4}) ; port PWDN4
NetU26_50: U26.50(~{PWDN3}) ; port PWDN3
NetU26_51: U26.51(~{PWDN2}) ; port PWDN2
NetU26_52: U26.52(~{PWDN1}) ; port PWDN1

Not connected (* = marked no-connect by the designer): U25 1(NC)* 3(TEMP)* 7(NC)* 8(NC)*; U26 18(DOUT8) 19(DOUT7) 20(DOUT6) 58(AINP8)* 59(AINN8)* 61(AINP7)* 62(AINN7)* 64(AINP6)* 65(AINN6)* 67(AINP5)* 68(AINN5)* 73(VCOM) 80(AINP4)* 81(AINN4)*

### Notes on the sheet
- 注1
- 注3
- 注2
- 注1：只焊接R67
- 注2：只焊接R73、R75
- 注3：只焊接R72、R76、R79

### Library data of the parts
C101 C103 = Y20024818: Polarized Capacitor; 制造商型号: T499D106K050AT; 精度: ±10%; 描述: KEMET;T499D106K050AT;10uF;±10%;50V;175℃;CAP2917; 安装形式: SMT; 产品外形尺寸<长>: 7.3±0.30mm; 产品外形尺寸<宽>: 4.3±0.30mm; 产品外形尺寸<高>: 2.8±0.30mm; id: wt.part.WTPartMaster:1056718; state: APPROVED; folder: /Default/电容/T499D106K050AT; Part Number: Y20024818; HelpURL: \\10.185.226.160\altium_center_db\DATASHEET\KEMET T498&T499ns.pdf; pname: T499D106K050AT
C102 C104-C106 C111-C113 = Y20025084: as C22 on sheet DSP_R; Part Number: Y20025084; HelpURL: \\10.185.226.160\altium_center_db\DATASHEET\VISHAY VJ X8R.pdf; Library Path: Cap.SchLib; Library Ref: Cap; Footprint Path: VISHAY VJ0805_57.PcbLib; Footprint Ref: CAPS0805_57; pname: VJ0805H104KXA; Library Path 2: 0; Library Ref 2: 0; Footprint Path 2: 0; Footprint Ref 2: 0; Footprint Path 3: 0; Footprint Ref 3: 0
C107-C110 = Y20024113: Capacitor; 制造商型号: C1206C105K5RAC; parent: 01; 精度: ±10%; 描述: KEMET;C1206C105K5RAC;1uF;±10%;50V;X7R;125℃;CAP1206 MSL1; 安装形式: SMT; 湿敏等级（回流焊峰值）: MSL1; 产品外形尺寸<长>: 3.2±0.2 mm; 产品外形尺寸<宽>: 1.6±0.2 mm; 产品外形尺寸<高>: 1.0±0.1 mm; Library Path 2: 0; id: wt.part.WTPartMaster:1055130; state: APPROVED; folder: /Default/电容/C1206C105K5RAC; Part Number: Y20024113; HelpURL: \\10.185.226.160\altium_center_db\DATASHEET\KEMET X7R Dielectric(Commercial Grade).pdf; Library Path: Cap.SchLib; Library Ref: Cap; Footprint Path: KEMET C1206_43.PcbLib; Footprint Ref: CAPS1206_43; pname: C1206C105K5RAC; Library Ref 2: 0; Footprint Path 2: 0; Footprint Ref 2: 0; Footprint Path 3: 0; Footprint Ref 3: 0
GND1 GND2 = TEST_LARGE
R66-R82 = Res: as R12 on sheet DSP_R; Published: 08/06/2000; Publisher: Altium Hobart Technology Centre; SubClass: Resistor
U25 = REF5025ID
U26 = ADS1278SHFQ

## Nets that join several sheets
A_5V: Assistant_Parameters (19 pins), ADC (15 pins)
D_1V8: DSP_R (19 pins), ADC (C113.2 U26.35 U26.36)
D_3V3: DSP_R (27 pins), Assistant_Parameters (5 pins), ADC (11 pins)
DGND: DSP_R (62 pins), Assistant_Parameters (C83.1 C84.1 U16.5), ADC (18 pins)
GND: Assistant_Parameters (28 pins), ADC (32 pins)
AD_REF: Assistant_Parameters (U18.3), ADC (6 pins)
NetCHARGER_1: Assistant_Parameters (CHARGER.1 U17.5 U17.6), ADC (U26.4)
NetCTRL_SW1_1: DSP_R (U4.94), Assistant_Parameters (CTRL_SW1.1 U19.6)
NetPT_TEMP1_1: Assistant_Parameters (PT_TEMP1.1 U20.6), ADC (U26.1)
NetPT_TEMP2_1: Assistant_Parameters (PT_TEMP2.1 U22.6), ADC (U26.83)